# EAGLE design Final (EAGLE 9.6.2)
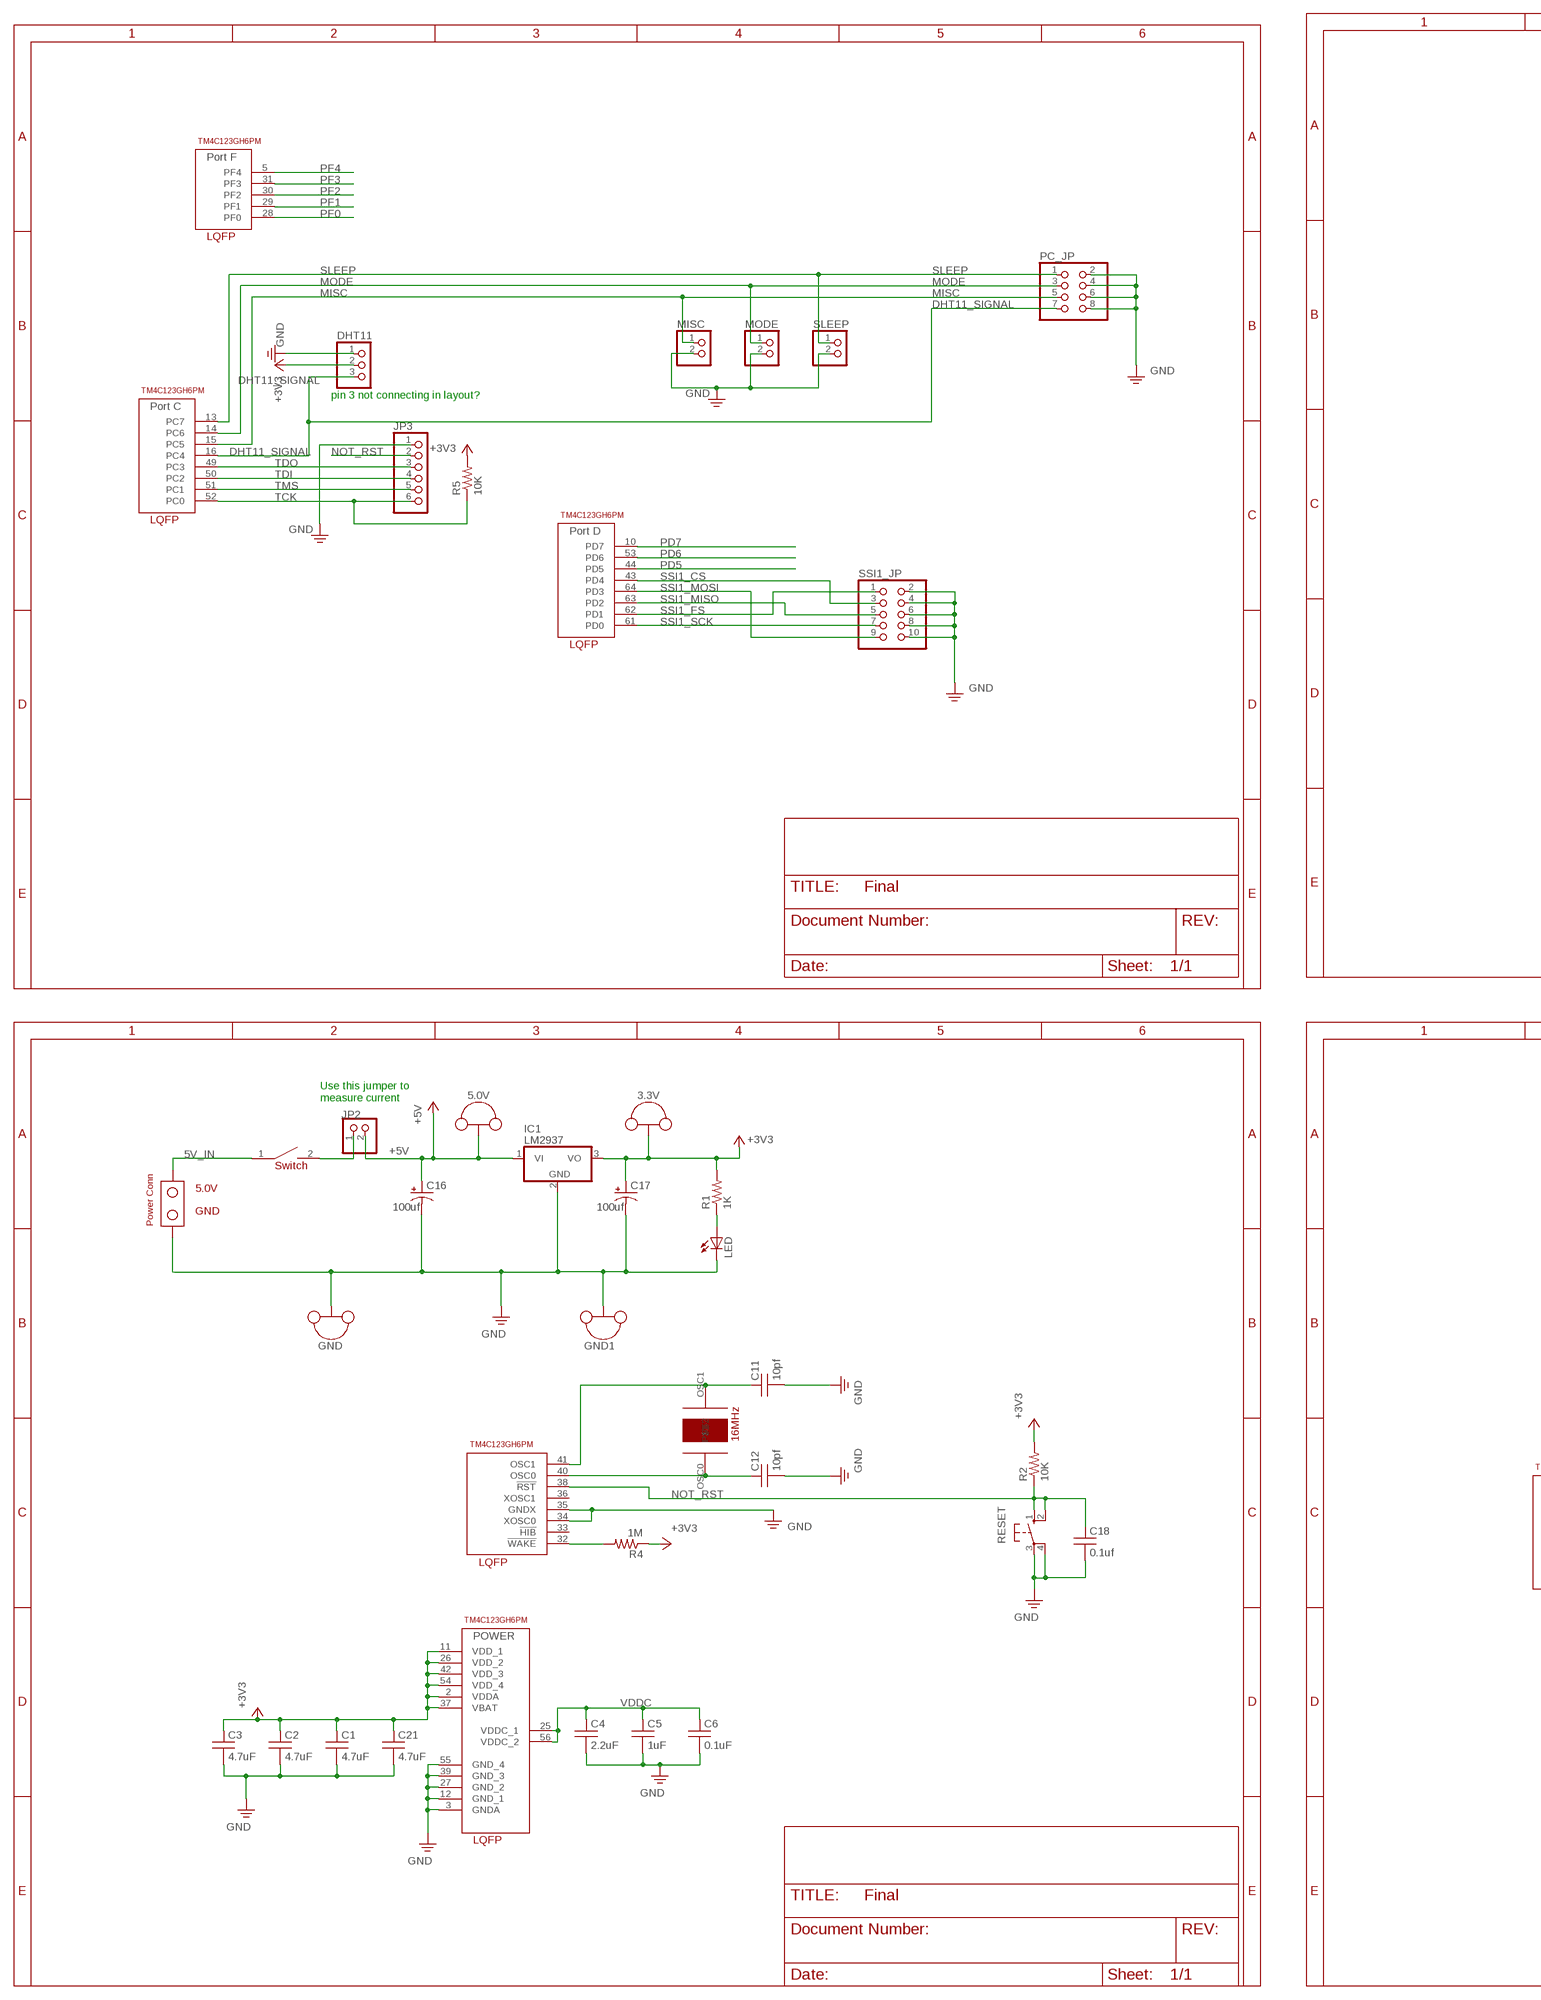
[diagram p0: schematic, sheet 1, part 1 of 2]
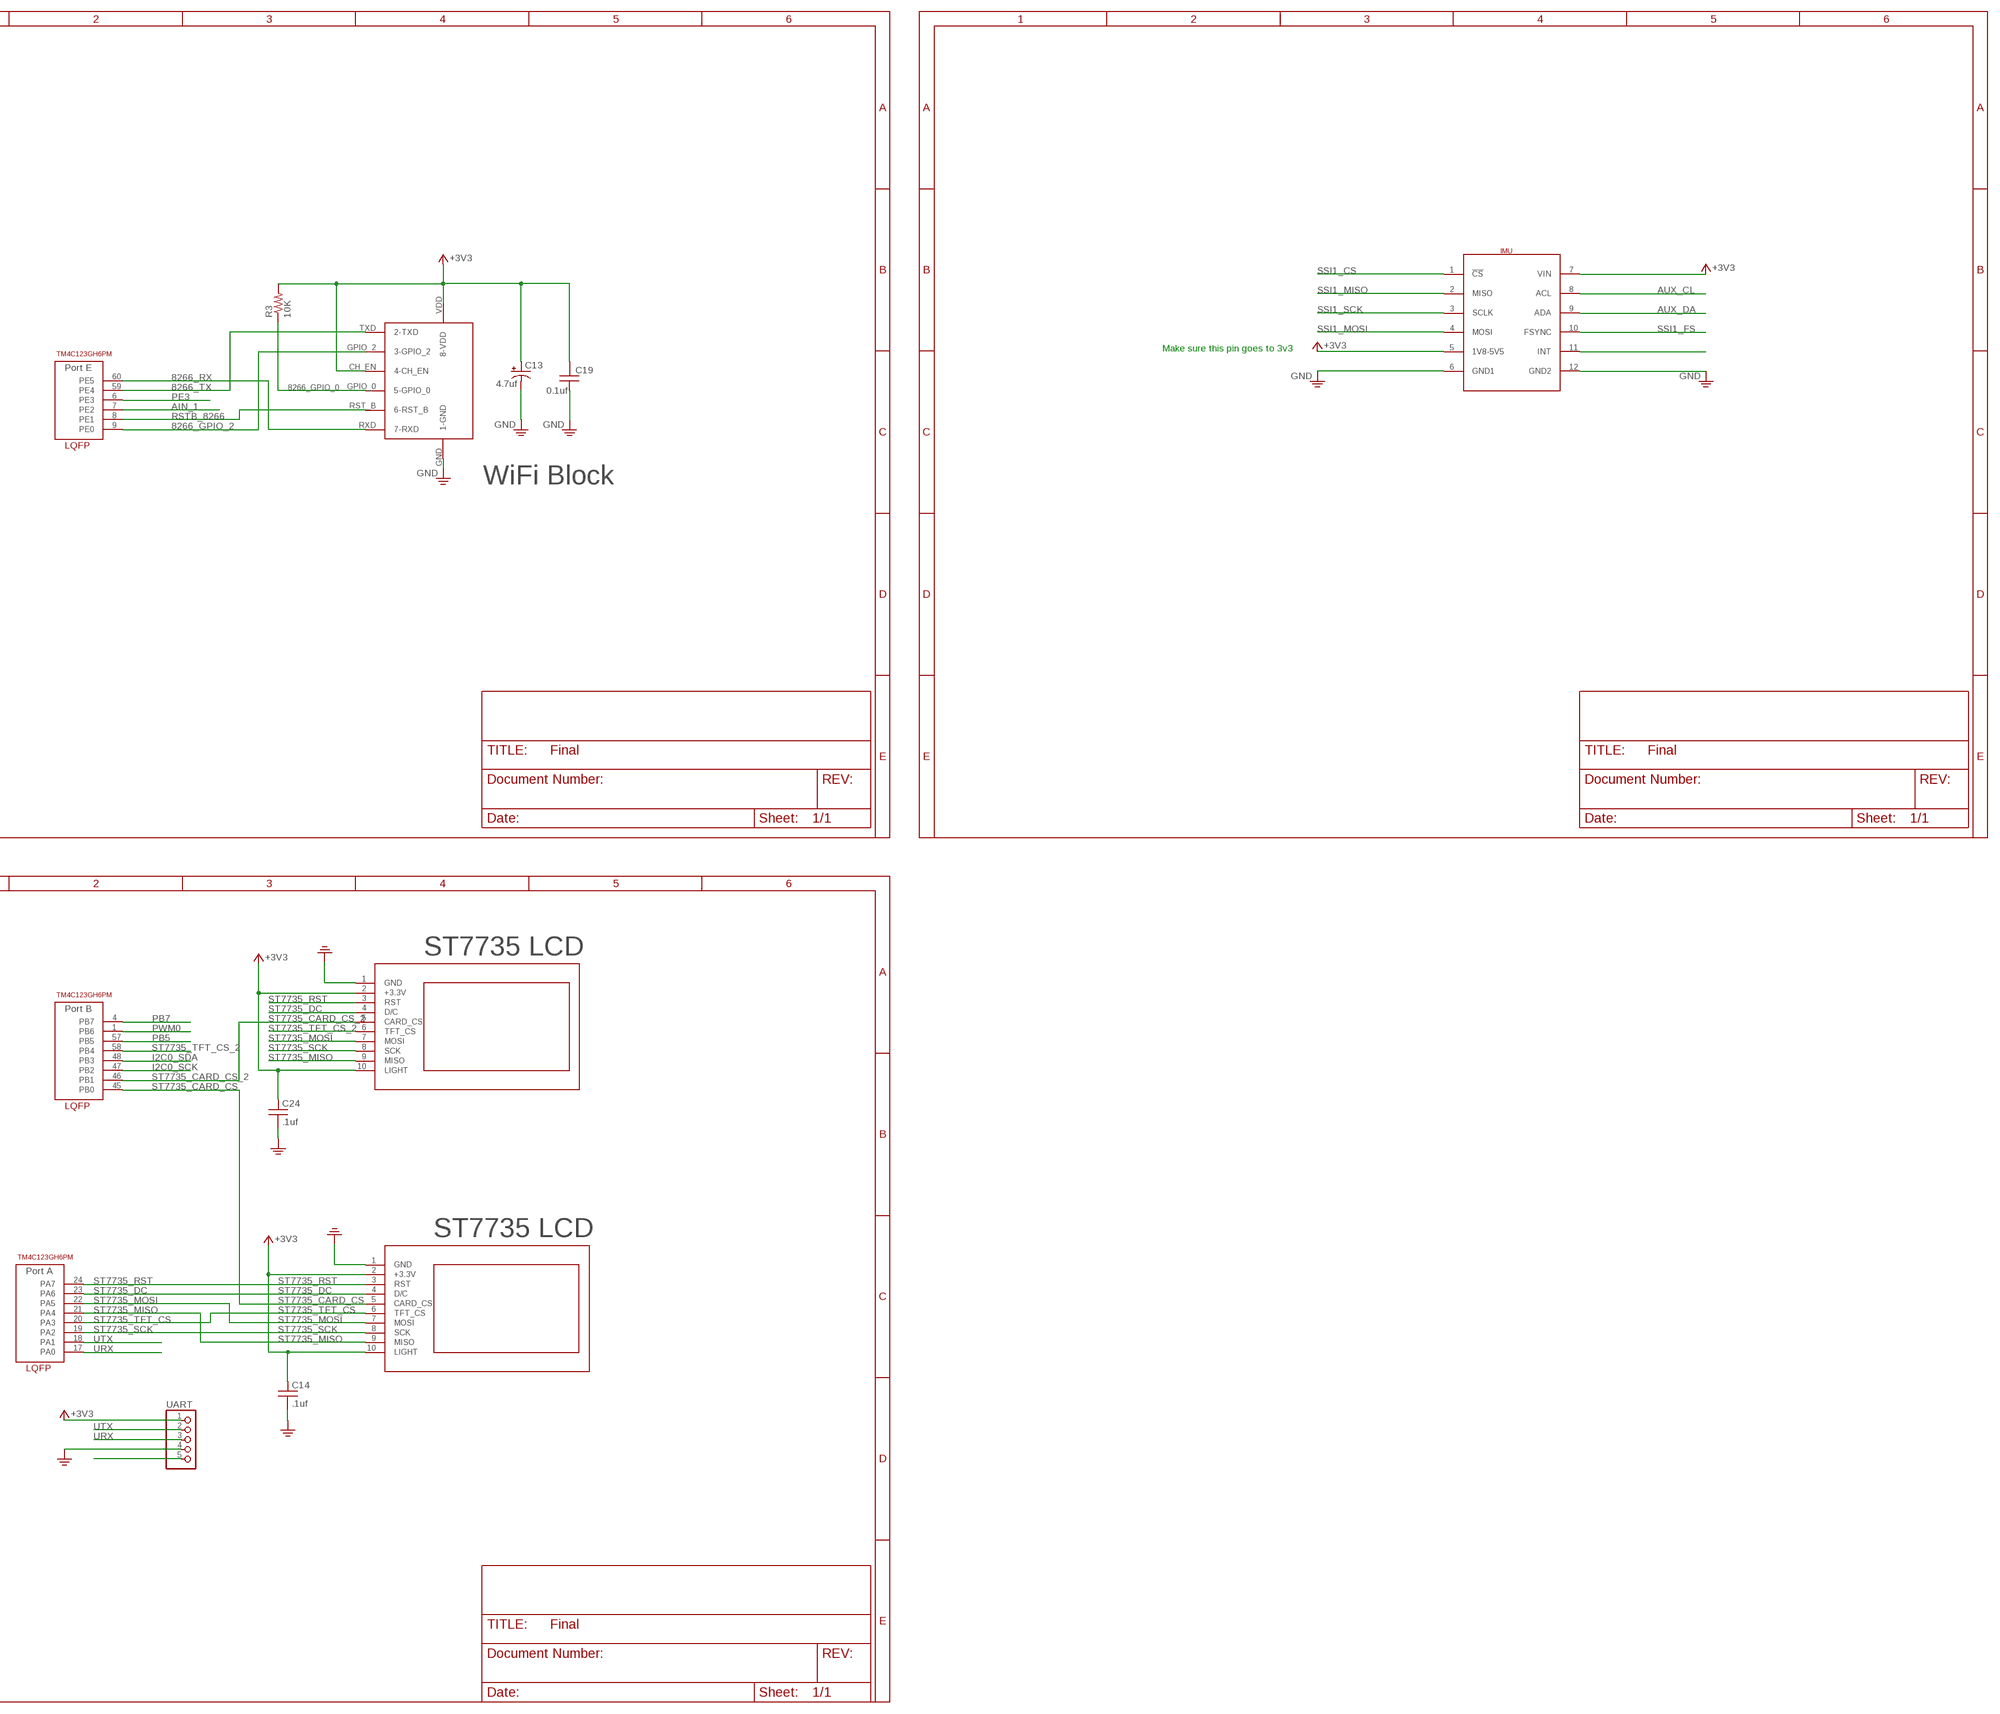
[diagram p1: schematic, sheet 1, part 2 of 2]

## Parts
3.3V  TP_LOOP  [TP_LOOP]
5.0V  TP_LOOP  [TP_LOOP]
C1  4.7uF  CAPACITORC0603K  [C0603K]
C2  4.7uF  CAPACITORC0603K  [C0603K]
C3  4.7uF  CAPACITORC0603K  [C0603K]
C4  2.2uF  CAPACITORC0603K  [C0603K]
C5  1uF  CAPACITORC0603K  [C0603K]
C6  0.1uF  CAPACITORC0603K  [C0603K]
C11  10pf  CAPACITOR025-024X044  [CAP100MIL]
C12  10pf  CAPACITOR025-024X044  [CAP100MIL]
C13  4.7uf  CAPACITOR_POLARIZEDE5-6  [CAP200MILPOLARIZED]
C14  .1uf  CAPACITOR050-024X044  [CAP200MIL]
C16  100uf  CAPACITOR_POLARIZEDE5-6  [CAP200MILPOLARIZED]
C17  100uf  CAPACITOR_POLARIZEDE5-6  [CAP200MILPOLARIZED]
C18  0.1uf  CAPACITOR025-024X044  [CAP100MIL]
C19  0.1uf  CAPACITOR050-024X044  [CAP200MIL]
C21  4.7uF  CAPACITORC0603K  [C0603K]
C24  .1uf  CAPACITOR050-024X044  [CAP200MIL]
DHT11  PINHD-1X3  [1X03]
GND  TP_LOOP  [TP_LOOP]
GND1  TP_LOOP  [TP_LOOP]
IC1  LM2937  [TO220]
IMU  SEN-15335  [SEN-15335]
JP2  PINHD-1X2  [1X02]
JP3  PINHD-1X6  [1X06]
LED  LED5MM  [LED5MM]
MISC  PINHD-1X2  [1X02]
MODE  PINHD-1X2  [1X02]
PC_JP  PINHD-2X4  [2X04]
POWER_SWITCH  SW_POWER_100MIL  [SW_POWER]
R1  1K  RESISTOR0204/5  [RES200MIL]
R2  10K  RESISTOR0204/5  [RES200MIL]
R3  10K  RESISTOR0204/7  [RES300MIL]
R4  1M  RESISTOR0204/5  [RES200MIL]
R5  10K  RESISTOR0204/5  [RES200MIL]
RESET  B3F-1052  [B3F-10XX]
SLEEP  PINHD-1X2  [1X02]
SSI1_JP  PINHD-2X5  [2X05]
U$1  TM4C123GH6PM  [QFP50P1200X1200X160-64N]
U$2  16MHZ_CRYSTAL  [16MHZ_CRYSTAL]
U$3  ESP_8266  [ESP8266]
U$4  POWER_CONN  [POWER_CONN]
U$5  ST7735  [ST7735]
U$6  ST7735  [ST7735]
UART  PINHD-1X5  [1X05]

## Nets
5V_IN: POWER_SWITCH.1 U$4.VDD
8266_GPIO_0: R3.1 U$3.GPIO_0(5-GPIO_0)
8266_GPIO_2: U$1.9(PE0) U$3.GPIO_2(3-GPIO_2)
8266_RX: U$1.60(PE5) U$3.RXD(7-RXD)
8266_TX: U$1.59(PE4) U$3.TXD(2-TXD)
+3V3: 3.3V.P$1(TP) 3.3V.P$2(TP) C1.1 C2.1 C3.1 C13.+ C14.1 C17.+ C19.2 C21.1 C24.1 DHT11.2 IC1.3(VO) IMU.5(1V8-5V5) IMU.7(VIN) R1.2 R2.2 R3.2 R4.1 R5.2 U$1.2(VDDA) U$1.11(VDD_1) U$1.26(VDD_2) U$1.37(VBAT) U$1.42(VDD_3) U$1.54(VDD_4) U$3.CH_EN(4-CH_EN) U$3.VDD(8-VDD) U$5.2(+3.3V) U$5.10(LIGHT) U$6.2(+3.3V) U$6.10(LIGHT) UART.1
+5V: 5.0V.P$1(TP) 5.0V.P$2(TP) C16.+ IC1.1(VI) JP2.2
AIN_1: U$1.7(PE2)
AUX_CL: IMU.8(ACL)
AUX_DA: IMU.9(ADA)
CURRENT_1: JP2.1 POWER_SWITCH.2
DHT11_SIGNAL: DHT11.3 PC_JP.7 U$1.16(PC4)
GND: C1.2 C2.2 C3.2 C4.2 C5.2 C6.2 C11.2 C12.2 C13.- C14.2 C16.- C17.- C18.2 C19.1 C21.2 C24.2 DHT11.1 GND1.P$1(TP) GND1.P$2(TP) GND.P$1(TP) GND.P$2(TP) IC1.2(GND) IMU.6(GND1) IMU.12(GND2) JP3.1 LED.K(C) MISC.2 MODE.2 PC_JP.2 PC_JP.4 PC_JP.6 PC_JP.8 RESET.3(P) RESET.4(P1) SLEEP.2 SSI1_JP.2 SSI1_JP.4 SSI1_JP.6 SSI1_JP.8 SSI1_JP.10 U$1.3(GNDA) U$1.12(GND_1) U$1.27(GND_2) U$1.34(XOSC0) U$1.35(GNDX) U$1.39(GND_3) U$1.55(GND_4) U$3.GND(1-GND) U$4.GND U$5.1(GND) U$6.1(GND) UART.4
I2C0_SCK: U$1.47(PB2)
I2C0_SDA: U$1.48(PB3)
LED_CATHODE: LED.A R1.1
MISC: MISC.1 PC_JP.5 U$1.15(PC5)
MODE: MODE.1 PC_JP.3 U$1.14(PC6)
N$5: UART.5
N$16: IMU.11(INT)
NOT_RST: C18.1 JP3.2 R2.1 RESET.1(S) RESET.2(S1) U$1.38(!RST)
NOT_WAKE: R4.2 U$1.32(!WAKE)
OSC0: C12.1 U$1.40(OSC0) U$2.OSC0
OSC1: C11.1 U$1.41(OSC1) U$2.OSC1
PB5: U$1.57(PB5)
PB7: U$1.4(PB7)
PD5: U$1.44(PD5)
PD6: U$1.53(PD6)
PD7: U$1.10(PD7)
PE3: U$1.6(PE3)
PF0: U$1.28(PF0)
PF1: U$1.29(PF1)
PF2: U$1.30(PF2)
PF3: U$1.31(PF3)
PF4: U$1.5(PF4)
PWM0: U$1.1(PB6)
RSTB_8266: U$1.8(PE1) U$3.RST_B(6-RST_B)
SLEEP: PC_JP.1 SLEEP.1 U$1.13(PC7)
SSI1_CS: IMU.1(!CS) SSI1_JP.3 U$1.43(PD4)
SSI1_FS: IMU.10(FSYNC) SSI1_JP.1 U$1.62(PD1)
SSI1_MISO: IMU.2(MISO) SSI1_JP.5 U$1.63(PD2)
SSI1_MOSI: IMU.4(MOSI) SSI1_JP.9 U$1.64(PD3)
SSI1_SCK: IMU.3(SCLK) SSI1_JP.7 U$1.61(PD0)
ST7735_CARD_CS: U$1.45(PB0) U$5.5(CARD_CS)
ST7735_CARD_CS_2: U$1.46(PB1) U$6.5(CARD_CS)
ST7735_DC: U$1.23(PA6) U$5.4(D/C) U$6.4(D/C)
ST7735_MISO: U$1.21(PA4) U$5.9(MISO) U$6.9(MISO)
ST7735_MOSI: U$1.22(PA5) U$5.7(MOSI) U$6.7(MOSI)
ST7735_RST: U$1.24(PA7) U$5.3(RST) U$6.3(RST)
ST7735_SCK: U$1.19(PA2) U$5.8(SCK) U$6.8(SCK)
ST7735_TFT_CS: U$1.20(PA3) U$5.6(TFT_CS)
ST7735_TFT_CS_2: U$1.58(PB4) U$6.6(TFT_CS)
TCK: JP3.6 R5.1 U$1.52(PC0)
TDI: JP3.4 U$1.50(PC2)
TDO: JP3.3 U$1.49(PC3)
TMS: JP3.5 U$1.51(PC1)
URX: U$1.17(PA0) UART.3
UTX: U$1.18(PA1) UART.2
VDDC: C4.1 C5.1 C6.1 U$1.25(VDDC_1) U$1.56(VDDC_2)
Unconnected: U$1.33(!HIB) U$1.36(XOSC1)

## Notes on the sheet
- pin 3 not connecting in layout?
- Make sure this pin goes to 3v3
- WiFi Block
- Use this jumper to
  measure current
- ST7735 LCD
- ST7735 LCD

## Library data of the parts
3.3V 5.0V GND GND1 = EE445L:TP_LOOP
C1-C6 C11 C12 C14 C18 C19 C21 C24 = EE445L:CAPACITOR: CAPACITOR, American symbol
C13 C16 C17 = EE445L:CAPACITOR_POLARIZED: POLARIZED CAPACITOR, American symbol
DHT11 = adafruit:PINHD-1X3: PIN HEADER
IC1 = EE445L:LM2937: LM2937-2.5, LM2937-3.3 400mA and 500mA Voltage Regulators Source: http://cache.national.com/ds/LM/LM2937-2.5.pdf
IMU = DakotaLib:SEN-15335: SparkFun SEN-15335 9DOF IMU BREAKOUT - ICM-20948
JP2 MISC MODE SLEEP = EE445L:PINHD-1X2: PIN HEADER
JP3 = EE445L:PINHD-1X6: PIN HEADER
LED = EE445L:LED: Avago Technologies LED Green 2mA 5mm diffused, HLMP-4740, Digikey 516-1327-ND Red 1.6V 1mA 5mm diffused, HLMP-D150, Digikey 516-1323-ND Yellow 2mA 5mm diffused, HLMP-4719, Digikey 516-1326-ND Orange 10mA 5mm diffused HLMP-D401, Digikey 516-1330-ND Blue 10mA 5mm diffused
PC_JP = EE445L:PINHD-2X4: PIN HEADER
POWER_SWITCH = EE445L:SW_POWER_100MIL
R1-R5 = EE445L:RESISTOR: RESISTOR, American symbol
RESET = EE445L:B3F-1052: OMRON SWITCH 1.1mm holes; MPN: B3F-1000; OC_FARNELL: 176432; OC_NEWARK: 36M3542
SSI1_JP = EE445L:PINHD-2X5: PIN HEADER
U$1 = EE445L:TM4C123GH6PM
U$2 = EE445L:16MHZ_CRYSTAL
U$3 = EE445L:ESP_8266
U$4 = EE445L:POWER_CONN
U$5 U$6 = EE445L:ST7735
UART = EE445L:PINHD-1X5: PIN HEADER

## Board
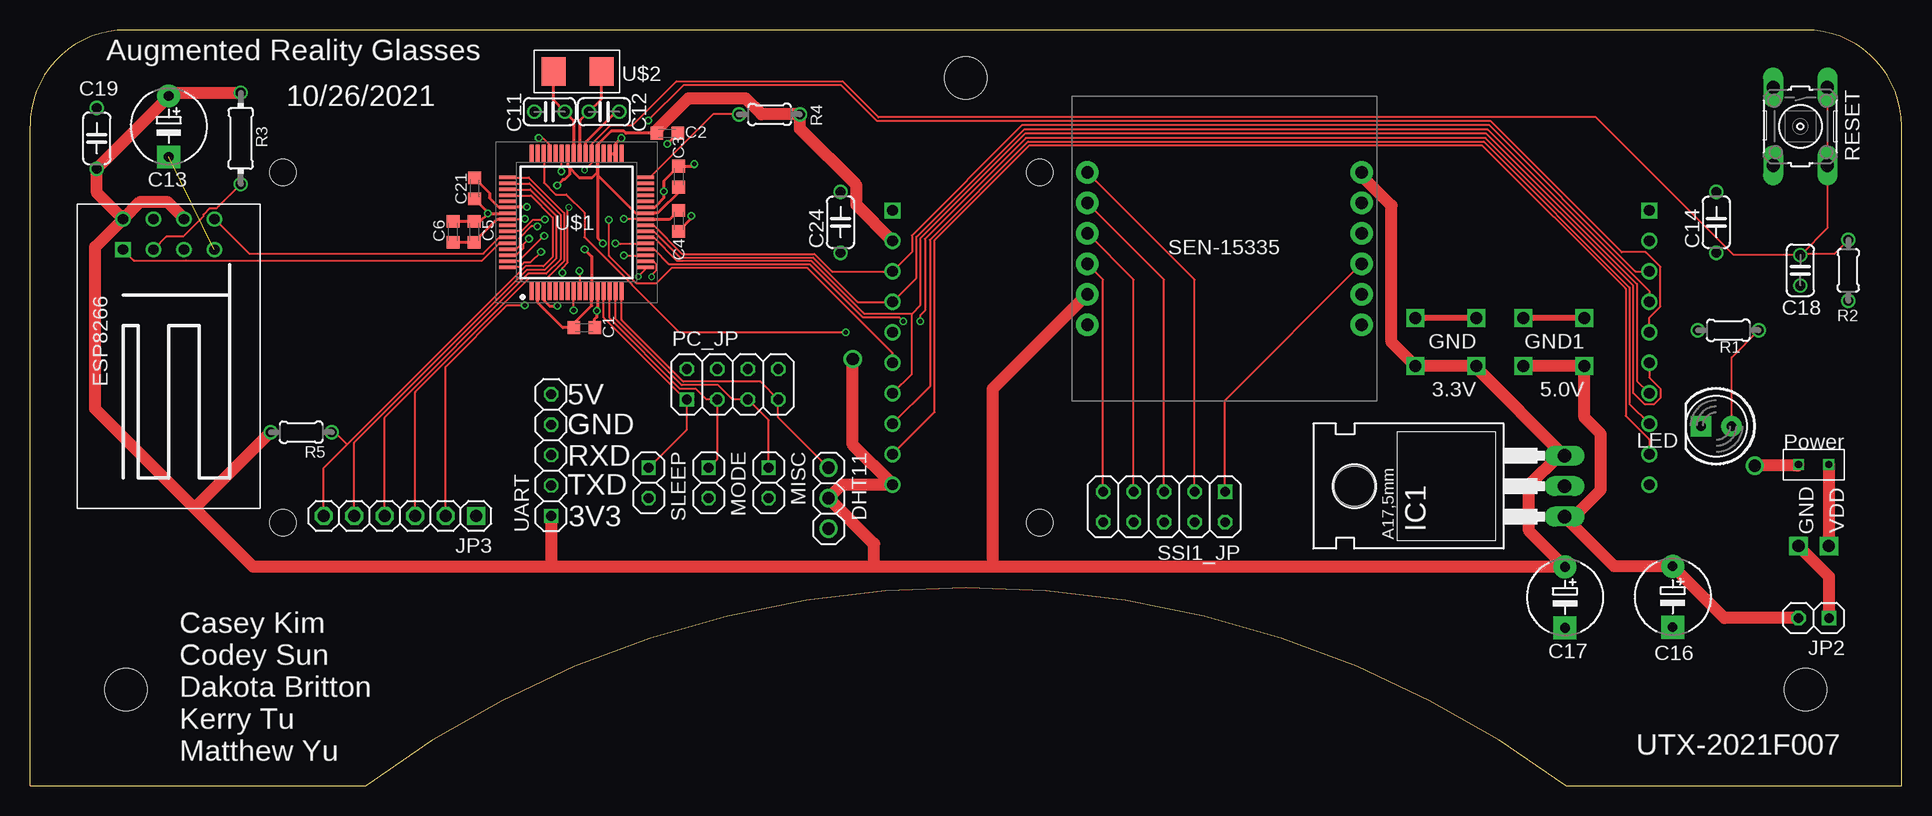
[diagram p2: board, top side]
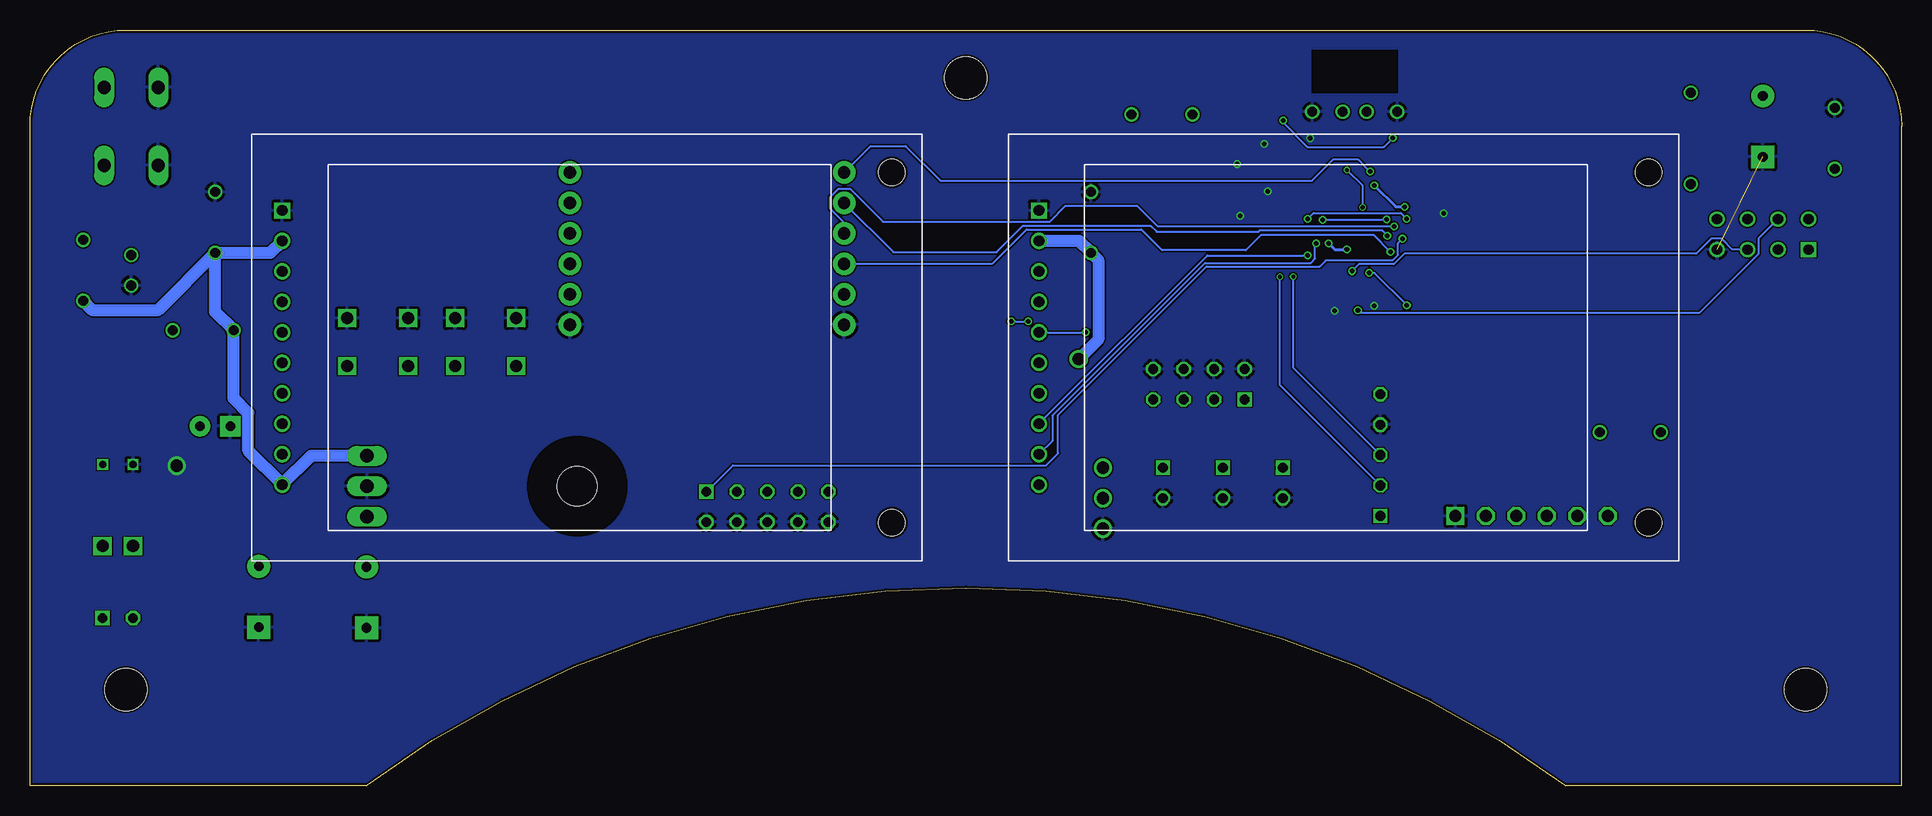
[diagram p3: board, bottom side, seen from below]

Size 156 x 63 mm. Coordinates in mm from the lower left corner, seen from the top.
Outline: 0,0 28,0 arc-37 78,16.5 arc-37 128,0 156,0 156,55 arc90 148,63 8,63 arc90 0,55 0,0
Copper layers (1*16): Top 0.035559375mm / dielectric 1.6mm / Bottom 0.035559375mm
Design rules "jlcpcb2layer": minimum track width 5mil, minimum drill 12mil, track to track 5mil, track to pad 5mil, pad to pad 5mil, via to via 5mil, smd to smd 5mil, copper to edge 8mil, drill to drill 6mil, minimum pad ring 5mil, minimum via ring 3mil, stop-mask expansion 2.5mil, vias tented up to drill 0mil, thermal gap 10mil
Holes 3.5 mm at 8,8 148,8 78,59

### Footprints (pad centres in the part's own frame; a part is rotated, then mirrored left to right if it is on the bottom)
TP_LOOP = drill 1 square: P$1 0,0; P$2 5.08,0
C0603K = smd 1.05 x 1.08: 1 -0.875,0; 2 0.875,0
CAP100MIL = drill 0.8: 1 -1.27,0; 2 1.27,0
CAP200MILPOLARIZED = drill 0.8 pad 1.905: + -2.54,0 | drill 0.8 pad 1.905 square: - 2.54,0
CAP200MIL = drill 0.8: 1 -2.54,0; 2 2.54,0
1X03 = drill 1.016: 1 -2.54,0; 2 0,0; 3 2.54,0
TO220 = drill 1.1 long: 1 -2.54,-6.35; 2 0,-6.35; 3 2.54,-6.35 | hole 3.302: 0,11.176
SEN-15335 = drill 1.016 pad 1.88: 1 -11.43,6.35; 2 -11.43,3.81; 3 -11.43,1.27; 4 -11.43,-1.27; 5 -11.43,-3.81; 6 -11.43,-6.35; 7 11.43,6.35; 8 11.43,3.81; 9 11.43,1.27; 10 11.43,-1.27; 11 11.43,-3.81; 12 11.43,-6.35
1X02 = drill 0.8 square: 1 -1.27,0 | drill 0.8 octagon: 2 1.27,0
1X06 = drill 1 square: 1 -6.35,0 | drill 1 octagon: 2 -3.81,0; 3 -1.27,0; 4 1.27,0; 5 3.81,0; 6 6.35,0
LED5MM = drill 0.8 pad 1.676: A -1.27,0 | drill 0.8 pad 1.676 square: K 1.27,0
2X04 = drill 0.8 square: 1 -3.81,-1.27 | drill 0.8 octagon: 2 -3.81,1.27; 3 -1.27,-1.27; 4 -1.27,1.27; 5 1.27,-1.27; 6 1.27,1.27; 7 3.81,-1.27; 8 3.81,1.27
SW_POWER = drill 1.016 square: 1 -1.27,0; 2 1.27,0
RES200MIL = drill 0.8: 1 -2.54,0; 2 2.54,0
RES300MIL = drill 0.8: 1 -3.81,0; 2 3.81,0
B3F-10XX = drill 1.1 long: 1 -3.251,2.261; 2 3.251,2.261; 3 -3.251,-2.261; 4 3.251,-2.261
2X05 = drill 0.8 square: 1 -5.08,-1.27 | drill 0.8 octagon: 2 -5.08,1.27; 3 -2.54,-1.27; 4 -2.54,1.27; 5 0,-1.27; 6 0,1.27; 7 2.54,-1.27; 8 2.54,1.27; 9 5.08,-1.27; 10 5.08,1.27
QFP50P1200X1200X160-64N = smd 1.475 x 0.3: 1 -5.738,3.75; 2 -5.738,3.25; 3 -5.738,2.75; 4 -5.738,2.25; 5 -5.738,1.75; 6 -5.738,1.25; 7 -5.738,0.75; 8 -5.738,0.25; 9 -5.738,-0.25; 10 -5.738,-0.75; 11 -5.738,-1.25; 12 -5.738,-1.75; 13 -5.738,-2.25; 14 -5.738,-2.75; 15 -5.738,-3.25; 16 -5.738,-3.75; 33 5.738,-3.75; 34 5.738,-3.25; 35 5.738,-2.75; 36 5.738,-2.25; 37 5.738,-1.75; 38 5.738,-1.25; 39 5.738,-0.75; 40 5.738,-0.25; 41 5.738,0.25; 42 5.738,0.75; 43 5.738,1.25; 44 5.738,1.75; 45 5.738,2.25; 46 5.738,2.75; 47 5.738,3.25; 48 5.738,3.75 | smd 0.3 x 1.475: 17 -3.75,-5.738; 18 -3.25,-5.738; 19 -2.75,-5.738; 20 -2.25,-5.738; 21 -1.75,-5.738; 22 -1.25,-5.738; 23 -0.75,-5.738; 24 -0.25,-5.738; 25 0.25,-5.738; 26 0.75,-5.738; 27 1.25,-5.738; 28 1.75,-5.738; 29 2.25,-5.738; 30 2.75,-5.738; 31 3.25,-5.738; 32 3.75,-5.738; 49 3.75,5.738; 50 3.25,5.738; 51 2.75,5.738; 52 2.25,5.738; 53 1.75,5.738; 54 1.25,5.738; 55 0.75,5.738; 56 0.25,5.738; 57 -0.25,5.738; 58 -0.75,5.738; 59 -1.25,5.738; 60 -1.75,5.738; 61 -2.25,5.738; 62 -2.75,5.738; 63 -3.25,5.738; 64 -3.75,5.738
16MHZ_CRYSTAL = smd 2 x 2.4: OSC0 1,1.27; OSC1 5,1.27
ESP8266 = drill 0.85: CH_EN 1.27,-1.27; GND -1.27,-3.81; GPIO_0 -1.27,1.27; GPIO_2 -1.27,-1.27; RST_B 1.27,1.27; TXD 1.27,-3.81; VDD 1.27,3.81 | drill 0.85 square: RXD -1.27,3.81
POWER_CONN = drill 0.6 square: GND 2.54,0; VDD 0,0
ST7735 = drill 0.9 square: 1 0,0 | drill 0.9: 2 0,-2.54; 3 0,-5.08; 4 0,-7.62; 5 0,-10.16; 6 0,-12.7; 7 0,-15.24; 8 0,-17.78; 9 0,-20.32; 10 0,-22.86 | hole 2.184: 50.8,3.175; 50.8,-26.035
1X05 = drill 0.8 square: 1 -5.08,0 | drill 0.8 octagon: 2 -2.54,0; 3 0,0; 4 2.54,0; 5 5.08,0

### Placement (x,y rotation side)
3.3V  120.56,34.96 180 top
5.0V  129.56,34.96 180 top
C1  46.2,38.18 0 top
C2  53.11,54.38 0 top
C3  54.08,50.77 90 top
C4  54.08,47.09 270 top
C5  37.03,46.18 90 top
C6  35.26,46.18 90 top
C11  43.3,56.18 180 top
C12  47.85,56.18 0 top
C13  11.56,54.96 270 top
C14  140.56,46.96 90 top
C16  136.93,15.74 270 top
C17  127.94,15.69 270 top
C18  147.56,42.96 270 top
C19  5.56,53.96 270 top
C21  37.06,49.78 270 top
C24  67.56,46.96 90 top
DHT11  66.56,23.96 90 top
GND  120.56,38.96 180 top
GND1  129.56,38.96 180 top
IC1  121.56,24.96 90 top
IMU  99.56,44.77 0 top
JP2  148.68,13.96 180 top
JP3  30.84,22.48 180 top
LED  140.56,29.96 180 top
MISC  61.56,25.23 270 top
MODE  56.56,25.23 270 top
PC_JP  58.56,33.46 0 top
POWER_SWITCH  148.68,19.97 180 top
R1  141.56,37.96 180 top
R2  151.56,42.96 270 top
R3  17.56,53.96 90 top
R4  61.64,55.96 180 top
R5  22.61,29.46 180 top
RESET  147.56,54.96 270 top
SLEEP  51.56,25.23 270 top
SSI1_JP  94.53,23.23 180 top
U$1  45.56,46.96 90 top
U$2  48.63,60.81 180 top
U$3  11.56,45.96 90 top
U$4  149.95,26.76 180 top
U$5  134.97,47.95 0 bottom
U$6  71.9,47.95 0 bottom
UART  43.43,27.56 90 top

### Tracks (layer width: path | path; a pad name or v marks a point on that pad's centre or on a via)
5V_IN
  Top 1.016: U$4.VDD POWER_SWITCH.1
8266_GPIO_0
  Top 0.152: U$3.GPIO_0 11.4,45.8 12.8,45.8 14.47,47.47 14.47,47.61 15,48.14 15.55,48.14 R3.1
8266_GPIO_2  (via drill 0.38 pad 0.64)
  Top 0.152: v45.8,42.9 45.81,42.89 U$1.9
  Bottom 0.152: v45.8,42.9 45.23,43.47 42.32,43.47 41.44,44.35 17.11,44.35 15.86,45.6 15,45.6 14.09,44.69 U$3.GPIO_2
8266_RX
  Top 0.152: U$3.RXD 8.66,43.78 13,43.78 37.69,43.78 39.09,45.19 39.8,45.19 U$1.60
8266_TX
  Top 0.152: U$1.59 39.15,45.71 37.78,44.35 18.28,44.35 15.4,47.23 U$3.TXD
+3V3  (via drill 0.38 pad 0.64, 1.02 pad 1.27)
  Top 0.254: U$1.37 47.31,50.91 50.52,47.7 U$1.26 52.3,47.71 54.25,49.66 54.25,49.72 C3.1 | U$1.37 47.32,51.16 46.83,50.66 45.81,50.66 44.81,51.67 U$1.42 44.81,51.64 44.97,51.48 44.97,50.92 44.58,50.53 44.43,50.53 v43.94,50.04 | v41.4,48.26 41.35,48.21 U$1.54 39.08,48.21 38.3,48.99 38.3,49.42 C21.1 | U$1.37 47.31,45.65 v47.75,45.21 | v46.23,44.7 46.81,44.12 U$1.11 46.81,40.02 45.33,38.53 C1.1 44.41,38.18 42.32,40.27 U$1.2 | C2.1 49.68,54.38 49.51,54.55 48.42,54.55 47.31,53.44 U$1.37
  Top 1.016: 80.26,18.23 C17.+ 124.94,21.23 124.94,25.02 127.43,27.5 IC1.3 120.56,34.85 3.3V.P$1 3.3V.P$2 113.48,36.96 113.48,48.36 110.99,50.85 IMU.7 | 80.26,18.23 70.36,18.23 | 70.36,18.23 43.43,18.23 | 43.43,18.23 18.6,18.23 13.69,23.14 | U$3.VDD 5.42,44.9 5.42,31.41 13.69,23.14 | U$3.VDD 5.56,49.42 C19.2 11.56,57.42 C13.+ 11.83,57.77 R3.2 | U$3.VDD 7.76,47.23 9.21,48.67 11.43,48.67 12.83,47.27 U$3.CH_EN | 80.26,18.23 80.26,33.09 IMU.5 | 70.36,18.23 70.36,20.17 DHT11.2 67.69,25.09 U$6.10 68.58,28.41 v68.58,35.56 | U$6.2 68.88,48.43 68.88,50.04 64.18,54.74 R4.1 60.96,55.96 59.65,57.27 54.87,57.27 52.24,54.65 C2.1 | R5.2 13.74,23.14 13.69,23.14 | UART.1 43.43,18.23
  Bottom 0.254: v43.94,50.04 42.16,48.26 v41.4,48.26 | v47.75,45.21 47.24,44.7 v46.23,44.7
  Bottom 1.016: IC1.3 132.56,27.5 U$5.10 137.79,27.91 137.79,31.07 139.02,32.3 R1.2 140.56,39.5 C14.1 | C14.1 135.96,44.42 U$5.2 | C14.1 145.36,39.62 150.77,39.62 R2.2 | v68.58,35.56 66.95,37.19 66.95,43.8 C24.1 68.55,45.41 U$6.2
+5V
  Top 1.016: JP2.2 141.25,13.96 C16.+ 132.05,18.28 IC1.1 128.03,22.54 128.82,22.54 130.94,24.65 130.94,29.31 129.56,30.68 5.0V.P$1 5.0V.P$2
CURRENT_1
  Top 1.016: POWER_SWITCH.2 149.95,17.43 JP2.1
DHT11_SIGNAL
  Top 0.152: DHT11.3 62.37,30.69 PC_JP.7 60.88,33.68 54.45,33.68 49.31,38.82 U$1.16
GND  (via drill 0.38 pad 0.64, 1.02 pad 1.27)  (1 unrouted)
  Top 0.152: 42.83,41.2 U$1.3 | 46.33,52.72 U$1.39
  Top 0.254: U$1.55 39.8,47.73 39.77,47.7 v38.18,47.7 | U$1.39 46.31,53.64 48.86,56.19 C12.2 | U$1.35 U$1.34 48.81,53.52 v49.28,53.98 | U$1.27 52.04,48.2 52.83,48.99 v52.83,49.53 52.83,50.41 C3.2 55.21,51.65 v55.37,51.82 | C21.2 38.18,47.79 v38.18,47.7 | C4.2 55.12,47.26 v55.12,47.5 | C1.2 47.08,38.9 47.24,39.06 v47.24,39.59 v47.24,39.6 47.31,39.67 U$1.12 | U$1.3 42.81,40.48 43.3,39.99 v43.97,39.99 | C2.2 53.14,53.53 v53.14,53.49 | C6.2 C5.2 37.53,47.05 v38.18,47.7
  Top 1.016: U$4.GND 147.32,26.67 v143.76,26.67
  pour Bottom: 0,63 0,0 156,0 156,63
LED_CATHODE
  Top 0.152: LED.A 141.83,35.69 R1.1
MISC
  Top 0.152: MISC.1 61.56,30.46 PC_JP.5 58.54,32.19 57.35,33.38 54.33,33.38 48.81,38.89 U$1.15
MODE
  Top 0.152: MODE.1 57.29,27.23 PC_JP.3 56.38,32.19 55.5,33.07 54.2,33.07 48.31,38.96 U$1.14
NOT_RST  (via drill 0.35, 0.38 pad 0.64)
  Top 0.152: 147.67,44.33 149.82,46.49 RESET.2 RESET.1 | 147.67,44.33 C18.1 142,44.23 130.52,55.71 70.72,55.71 67.72,58.71 53.91,58.71 50.24,55.05 48.38,55.05 46.84,53.51 46.84,52.72 U$1.38 46.81,51.91 v46.23,51.32 | R2.1 150.4,44.33 147.67,44.33 | JP3.2 34.65,34.9 39.79,40.05 v41.23,40.05 | v44.38,42.74 44.38,43.16 44.83,43.61 44.83,48.13 v44.91,48.21
  Bottom 0.152: v41.23,40.05 43.92,42.74 v44.38,42.74 | v44.91,48.21 44.91,50.01 v46.23,51.32
NOT_WAKE
  Top 0.152: U$1.32 51.67,50.71 56.92,55.96 R4.2
OSC0
  Top 0.254: U$2.OSC0 47.59,59.51 47.59,57.2 C12.1 45.81,55.42 U$1.40
OSC1
  Top 0.254: U$2.OSC1 43.63,57.13 C11.1 45.31,55.45 U$1.41
RSTB_8266  (via drill 0.38 pad 0.64)
  Top 0.152: v45.31,39.62 U$1.8 | U$1.8
  Bottom 0.152: U$3.RST_B 11.93,45.6 11.93,44.31 16.82,39.42 45.11,39.42 v45.31,39.62
SLEEP
  Top 0.152: SLEEP.1 54.75,29.69 PC_JP.1 54.65,32.19 47.81,39.03 U$1.13
SSI1_CS  (via drill 0.38 pad 0.64)
  Top 0.152: SSI1_JP.3 97.07,42.19 IMU.1 | v44.3,51.2 44.3,52.68 U$1.43
  Bottom 0.152: IMU.1 85.93,53.32 83,53.32 80.11,50.42 49.14,50.42 47.35,52.22 45.32,52.22 v44.3,51.2
SSI1_FS  (via drill 0.38 pad 0.64)
  Top 0.152: SSI1_JP.1 99.61,32.12 IMU.10 | v41.6,45.6 41.1,45.1 41.1,44.77 40.54,44.21 U$1.62
  Bottom 0.152: SSI1_JP.1 97.42,26.7 71.3,26.7 70.3,27.7 70.3,30.9 57.93,43.27 48.5,43.27 48,43.77 42.45,43.77 41.98,44.24 41.98,45.22 v41.6,45.6
SSI1_MISO  (via drill 0.38 pad 0.64)
  Top 0.152: SSI1_JP.5 94.53,42.19 IMU.2 | v42.86,45.84 40.73,43.71 U$1.63
  Bottom 0.152: v42.86,45.84 43.31,46.3 53.47,46.3 53.59,46.17 62.08,46.17 62.59,46.68 73.23,46.68 75.44,44.48 84.03,44.48 IMU.2
SSI1_MOSI  (via drill 0.38 pad 0.64)
  Top 0.152: SSI1_JP.9 89.45,42.19 IMU.4 | v42.6,44.5 41.71,43.61 41.17,43.61 40.77,43.21 U$1.64
  Bottom 0.152: IMU.4 75.79,43.5 72.93,46.36 63.37,46.36 61.65,44.63 54.65,44.63 53.36,45.92 44.02,45.92 v42.6,44.5
SSI1_SCK  (via drill 0.38 pad 0.64)
  Top 0.152: SSI1_JP.7 91.99,42.19 IMU.3 | v42.3,46.63 41.78,46.63 40.79,45.64 40.79,44.97 40.54,44.71 U$1.61
  Bottom 0.152: v42.3,46.63 62,46.63 63.72,48.35 69.67,48.35 71,47.02 84.92,47.02 87.65,49.75 88.62,49.75 89.3,49.07 89.3,48.1 88.13,46.93 IMU.3
ST7735_CARD_CS  (via drill 0.38 pad 0.64)
  Top 0.152: U$5.5 134.97,39.01 135.9,39.94 135.9,43.26 134.68,44.48 132.68,44.48 121.75,55.41 70.59,55.41 67.59,58.41 54.49,58.41 v51.54,55.46 | U$1.45 43.29,52.72 43.29,53.43 42.8,53.92 42.48,53.92 v42.4,54
  Bottom 0.152: v51.54,55.46 51.54,55.28 49.5,53.24 43.16,53.24 v42.4,54
ST7735_CARD_CS_2  (via drill 0.38 pad 0.64)
  Top 0.152: U$1.46 42.84,52.68 42.84,50.27 43.82,49.28 44.7,49.28 46.22,47.76 46.22,45.72 54.15,37.79 v68,37.79
  Bottom 0.152: U$6.5 v68,37.79
ST7735_DC
  Top 0.152: U$5.4 134.97,41.23 121.5,54.7 82.86,54.7 73.89,45.73 73.89,42.31 U$6.4 68.98,40.33 65.28,44.02 54.17,44.02 51.98,46.21 U$1.23
ST7735_MISO  (via drill 0.38 pad 0.64)
  Top 0.152: U$6.9 75.4,31.13 75.4,45.47 83.32,53.39 121.04,53.39 133.01,41.42 133.01,30.81 134.97,28.85 U$5.9 | v48.8,45.2 U$1.21
  Bottom 0.152: U$6.9 70.78,28.75 70.78,30.85 58.05,43.58 49.24,43.58 48.88,43.94 48.88,45.12 v48.8,45.2
ST7735_MOSI
  Top 0.152: 73.5,39.33 69.55,39.33 65.14,43.74 53.94,43.74 51.97,45.71 U$1.22 | U$6.7 73.5,34.31 73.5,39.33 | U$5.7 133.94,33.74 133.94,41.82 121.37,54.4 82.98,54.4 74.2,45.61 74.2,40.03 73.5,39.33
ST7735_RST
  Top 0.152: U$5.3 133.83,42.87 121.6,55.1 82.73,55.1 73.5,45.87 73.5,44.47 U$6.3 66.83,42.87 65.38,44.33 54.37,44.33 51.99,46.71 U$1.24
ST7735_SCK  (via drill 0.38 pad 0.64)
  Top 0.152: U$6.8 75,33.27 75,45.5 83.19,53.7 121.17,53.7 133.33,41.54 133.33,31.81 U$5.8 | v49.5,44.2 U$1.19
  Bottom 0.152: U$6.8 57.87,44.2 v49.5,44.2
ST7735_TFT_CS  (via drill 0.38 pad 0.64)
  Top 0.152: U$5.6 134.97,34.03 135.9,33.1 135.9,32.32 135.36,31.78 134.58,31.78 133.63,32.73 133.63,41.69 121.32,54 83.02,54 74.6,45.58 74.6,39.6 74.2,39.2 v74.2,38.7 | U$1.20 52.01,44.71 53.28,43.44 65.01,43.44 69.43,39.02 72.48,39.02 v72.8,38.7
  Bottom 0.152: v74.2,38.7 v72.8,38.7
ST7735_TFT_CS_2  (via drill 0.38 pad 0.64)
  Top 0.152: U$6.6 71.9,36.05 64.8,43.15 53.48,43.15 52.2,41.87 50.56,41.87 48.28,44.15 48.28,47.15 v48.26,47.17 | U$1.58 40.97,46.21 41.91,47.15 42.88,47.15 v42.92,47.19
  Bottom 0.152: v48.26,47.17 42.95,47.17 v42.92,47.19
TCK
  Top 0.152: U$1.52 39.85,49.19 41.75,49.19 43.57,47.37 43.57,44.07 42.8,43.3 41.3,43.3 26.43,28.43 | 26.43,28.43 24.48,26.49 24.49,26.49 JP3.6 | R5.1 25.4,29.46 26.43,28.43
TDI
  Top 0.152: U$1.50 39.85,50.19 41.64,50.19 44.21,47.62 44.21,43.86 43.03,42.67 41.53,42.67 29.56,30.71 29.57,30.7 JP3.4
TDO
  Top 0.152: U$1.49 39.85,50.69 41.57,50.69 44.53,47.74 44.53,43.74 43.09,42.31 41.62,42.31 32.1,32.79 32.11,32.79 JP3.3
TMS
  Top 0.152: U$1.51 39.85,49.69 41.7,49.69 43.87,47.52 43.87,43.95 42.91,42.99 41.41,42.99 27.02,28.6 27.03,28.6 JP3.5
URX  (via drill 0.35)
  Top 0.152: v50.7,42.44 51.3,43.05 U$1.17
  Bottom 0.152: UART.3 50.7,34.82 v50.7,42.44
UTX  (via drill 0.35)
  Top 0.152: U$1.18 51.32,43.69 52,43.69 52.24,43.44 52.24,42.98 51.82,42.55 v51.82,42.42
  Bottom 0.152: UART.2 51.82,33.4 v51.82,42.42
VDDC  (via drill 0.38 pad 0.64)
  Top 0.152: U$1.25 51.32,47.21 51.3,47.23 51.27,47.25 v49.49,47.25 | U$1.56 41.22,47.21 v41.26,47.25
  Top 0.254: 51.3,47.23 51.34,47.19 53.3,47.19 C4.1 | 39.09,47.22 U$1.56 38.94,47.21 C5.1 C6.1
  Bottom 0.152: v41.26,47.25 41.74,47.73 49.01,47.73 v49.49,47.25

### Text on the board
tNames: Augmented Reality Glasses | 10/26/2021 | 5V | GND | RXD | TXD | 3V3 | UTX-2021F007 | Casey Kim / Codey Sun / Dakota Britton / Kerry Tu / Matthew Yu